# EAGLE design UnoAdapter_v10 (EAGLE 6.4)
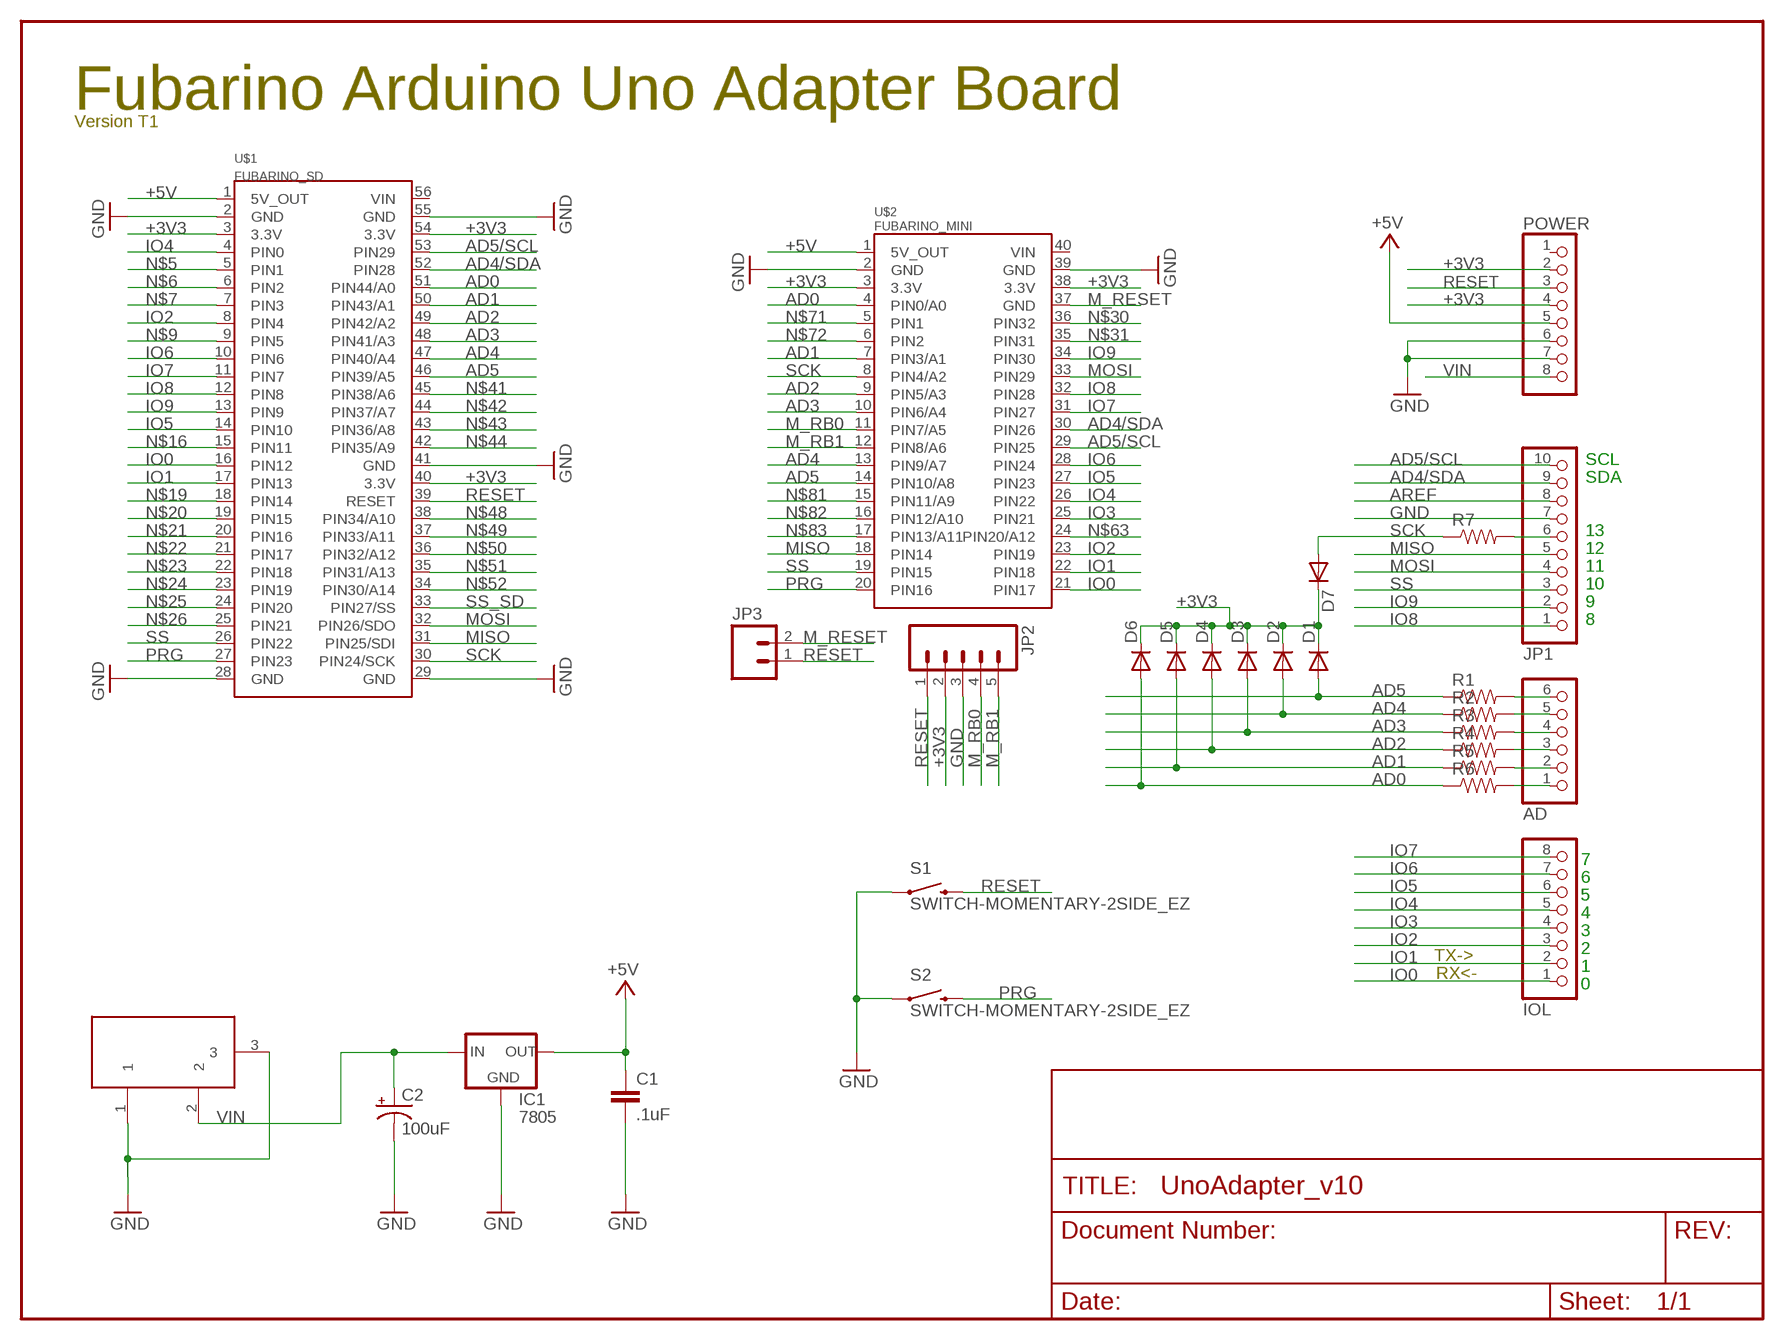
[diagram p0: schematic, sheet 1]

## Parts
AD  PINHD-1X6  [1X06]
C1  .1uF  CAPPTH  [CAP-PTH-SMALL]
C2  100uF  CAP_POLPTH1  [CPOL-RADIAL-100UF-25V]
D1  DIODE1N4148  [DIODE-1N4148]
D2  DIODE1N4148  [DIODE-1N4148]
D3  DIODE1N4148  [DIODE-1N4148]
D4  DIODE1N4148  [DIODE-1N4148]
D5  DIODE1N4148  [DIODE-1N4148]
D6  DIODE1N4148  [DIODE-1N4148]
D7  DIODE1N4148  [DIODE-1N4148]
IC1  7805  V_REG_78XXSIDE  [78XXL]
IOL  PINHD-1X8  [1X08]
JP1  PINHD-1X10  [1X10]
JP2  M05PTH  [1X05]
JP3  M02PTH  [1X02]
POWER  PINHD-1X8  [1X08]
R1  RESISTORAXIAL-0.3  [AXIAL-0.3]
R2  RESISTORAXIAL-0.3  [AXIAL-0.3]
R3  RESISTORAXIAL-0.3  [AXIAL-0.3]
R4  RESISTORAXIAL-0.3  [AXIAL-0.3]
R5  RESISTORAXIAL-0.3  [AXIAL-0.3]
R6  RESISTORAXIAL-0.3  [AXIAL-0.3]
R7  RESISTORAXIAL-0.3  [AXIAL-0.3]
S1  SWITCH-MOMENTARY-2SIDE_EZ  [TACTILE-PTH-SIDEEZ]
S2  SWITCH-MOMENTARY-2SIDE_EZ  [TACTILE-PTH-SIDEEZ]
U$1  FUBARINO_SD  [FUBARINO_SD]
U$2  FUBARINO_MINI  [FUBARINO_MINI]
X1  DC21MMX  [DC-21MM]

## Nets
$12: AD.6 R1.P$2
$13: AD.5 R2.P$2
$14: AD.4 R3.P$2
$15: AD.3 R4.P$2
$16: AD.2 R5.P$2
$17: AD.1 R6.P$2
$123: JP1.6 R7.P$2
+3V3: D1.C D2.C D3.C D4.C D5.C D6.C D7.C JP2.2 POWER.2 POWER.4 U$1.3(3.3V) U$1.40(3.3V) U$1.54(3.3V) U$2.3(3.3V) U$2.38(3.3V)
+5V: C1.1 IC1.OUT POWER.5 U$1.1(5V_OUT) U$2.1(5V_OUT)
AD0: D6.A R6.P$1 U$1.51(PIN44/A0) U$2.4(PIN0/A0)
AD1: D5.A R5.P$1 U$1.50(PIN43/A1) U$2.7(PIN3/A1)
AD2: D4.A R4.P$1 U$1.49(PIN42/A2) U$2.9(PIN5/A3)
AD3: D3.A R3.P$1 U$1.48(PIN41/A3) U$2.10(PIN6/A4)
AD4: D2.A R2.P$1 U$1.47(PIN40/A4) U$2.13(PIN9/A7)
AD4/SDA: JP1.9 U$1.52(PIN28) U$2.30(PIN26)
AD5: D1.A R1.P$1 U$1.46(PIN39/A5) U$2.14(PIN10/A8)
AD5/SCL: JP1.10 U$1.53(PIN29) U$2.29(PIN25)
AREF: JP1.8
GND: C1.2 C2.2(-) IC1.GND JP1.7 JP2.3 POWER.6 POWER.7 S1.1 S2.1 U$1.2(GND) U$1.28(GND) U$1.29(GND) U$1.41(GND) U$1.55(GND) U$2.2(GND) U$2.39(GND) X1.1 X1.3
IO0: IOL.1 U$1.16(PIN12) U$2.21(PIN17)
IO1: IOL.2 U$1.17(PIN13) U$2.22(PIN18)
IO2: IOL.3 U$1.8(PIN4) U$2.23(PIN19)
IO3: IOL.4 U$2.25(PIN21)
IO4: IOL.5 U$1.4(PIN0) U$2.26(PIN22)
IO5: IOL.6 U$1.14(PIN10) U$2.27(PIN23)
IO6: IOL.7 U$1.10(PIN6) U$2.28(PIN24)
IO7: IOL.8 U$1.11(PIN7) U$2.31(PIN27)
IO8: JP1.1 U$1.12(PIN8) U$2.32(PIN28)
IO9: JP1.2 U$1.13(PIN9) U$2.34(PIN30)
M_RB0: JP2.4 U$2.11(PIN7/A5)
M_RB1: JP2.5 U$2.12(PIN8/A6)
M_RESET: JP3.2 U$2.37(GND)
MISO: JP1.5 U$1.31(PIN25/SDI) U$2.18(PIN14)
MOSI: JP1.4 U$1.32(PIN26/SDO) U$2.33(PIN29)
N$5: U$1.5(PIN1)
N$6: U$1.6(PIN2)
N$7: U$1.7(PIN3)
N$9: U$1.9(PIN5)
N$16: U$1.15(PIN11)
N$19: U$1.18(PIN14)
N$20: U$1.19(PIN15)
N$21: U$1.20(PIN16)
N$22: U$1.21(PIN17)
N$23: U$1.22(PIN18)
N$24: U$1.23(PIN19)
N$25: U$1.24(PIN20)
N$26: U$1.25(PIN21)
N$30: U$2.36(PIN32)
N$31: U$2.35(PIN31)
N$41: U$1.45(PIN38/A6)
N$42: U$1.44(PIN37/A7)
N$43: U$1.43(PIN36/A8)
N$44: U$1.42(PIN35/A9)
N$48: U$1.38(PIN34/A10)
N$49: U$1.37(PIN33/A11)
N$50: U$1.36(PIN32/A12)
N$51: U$1.35(PIN31/A13)
N$52: U$1.34(PIN30/A14)
N$63: U$2.24(PIN20/A12)
N$71: U$2.5(PIN1)
N$72: U$2.6(PIN2)
N$81: U$2.15(PIN11/A9)
N$82: U$2.16(PIN12/A10)
N$83: U$2.17(PIN13/A11)
PRG: S2.2 U$1.27(PIN23) U$2.20(PIN16)
RESET: JP2.1 JP3.1 POWER.3 S1.2 U$1.39(RESET)
SCK: D7.A R7.P$1 U$1.30(PIN24/SCK) U$2.8(PIN4/A2)
SS: JP1.3 U$1.26(PIN22) U$2.19(PIN15)
SS_SD: U$1.33(PIN27/SS)
VIN: C2.1(+) IC1.IN POWER.8 X1.2
Unconnected: POWER.1 U$1.56(VIN) U$2.40(VIN)

## Notes on the sheet
- Fubarino Arduino Uno Adapter Board
- Version T1
- SCL
- SDA
- 13
- 12
- 11
- 10
- 9
- 8
- 7
- 6
- 5
- 4
- 3
- 2
- TX->
- 1
- RX<-
- 0

## Library data of the parts
AD = pinhead:PINHD-1X6: PIN HEADER
C1 = SparkFun-Capacitors:CAP: Capacitor Standard 0603 ceramic capacitor, and 0.1" leaded capacitor.
C2 = SparkFun-Capacitors:CAP_POL: Capacitor Polarized These are standard SMD and PTH capacitors. Normally 10uF, 47uF, and 100uF in electrolytic and tantalum varieties. Always verify the external diameter of the through hole cap, it varies with capacity, voltage, and manufacturer. The EIA devices should be standard.
D1-D7 = SparkFun-DiscreteSemi:DIODE: Diode These are standard reverse protection diodes and small signal diodes. SMA package can handle up to about 1A. SOD-323 can handle about 200mA. What the SOD-323 package when ordering, there are some mfgs out there that are 5-pin packages.
IC1 = SparkFun-PowerIC:V_REG_78XX: Voltage Regulator Standard 7805 5V regulator. IGO (Input Ground Output). Spark Fun Electronics SKU : COM-00107
IOL POWER = pinhead:PINHD-1X8: PIN HEADER
JP1 = pinhead:PINHD-1X10: PIN HEADER
JP2 = SparkFun-Connectors:M05: Header 5 Standard 5-pin 0.1" header. Use with straight break away headers (SKU : PRT-00116), right angle break away headers (PRT-00553), swiss pins (PRT-00743), machine pins (PRT-00117), and female headers (PRT-00115). Molex polarized connector foot print use with SKU : PRT-08230 with associated crimp pins and housings.
JP3 = SparkFun-Connectors:M02: Header 2 Standard 2-pin 0.1" header. Use with straight break away headers (SKU : PRT-00116), right angle break away headers (PRT-00553), swiss pins (PRT-00743), machine pins (PRT-00117), and female headers (PRT-00115). Molex polarized connector foot print use with SKU : PRT-08233 with associated crimp pins and housings.
R1-R7 = SparkFun-Passives:RESISTOR: Resistor Basic schematic elements and footprints for 0603, 1206, and PTH resistors.
S1 S2 = SparkFun-Electromechanical:SWITCH-MOMENTARY-2: Various NO switches- pushbuttons, reed, etc
U$1 = SchmalzHausPublic:FUBARINO_SD
U$2 = SchmalzHausPublic:FUBARINO_MINI
X1 = powersupply:DC21MM

## Net classes
0 default: width 0.152 mm, drill 0.305 mm, clearance 0.152 mm

## Board
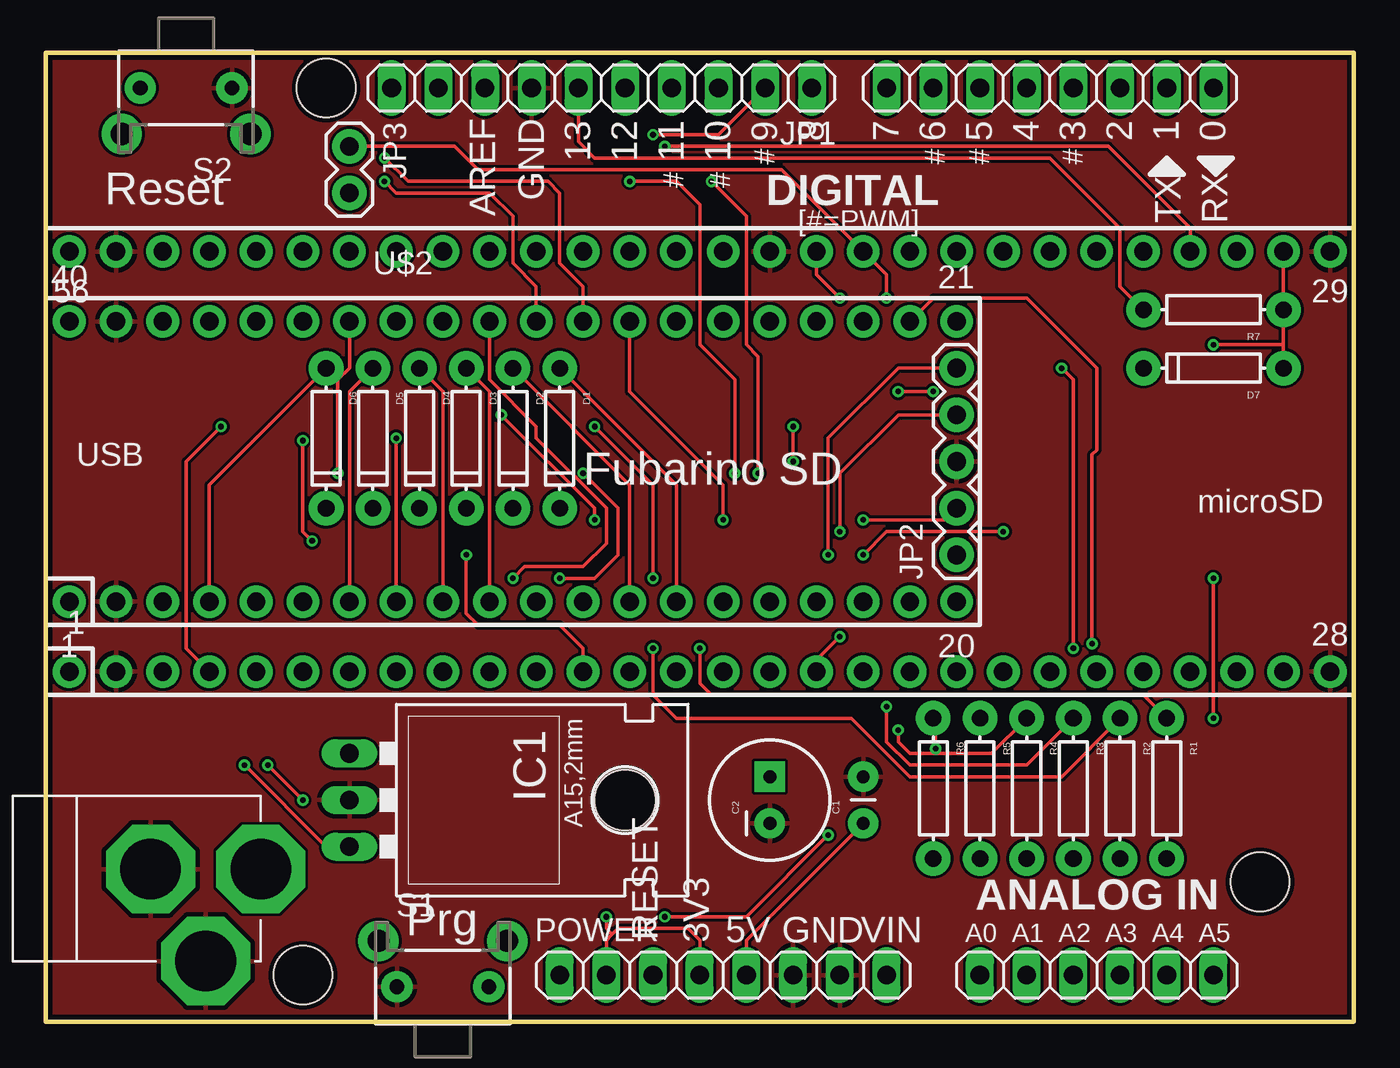
[diagram p1: board, top side]
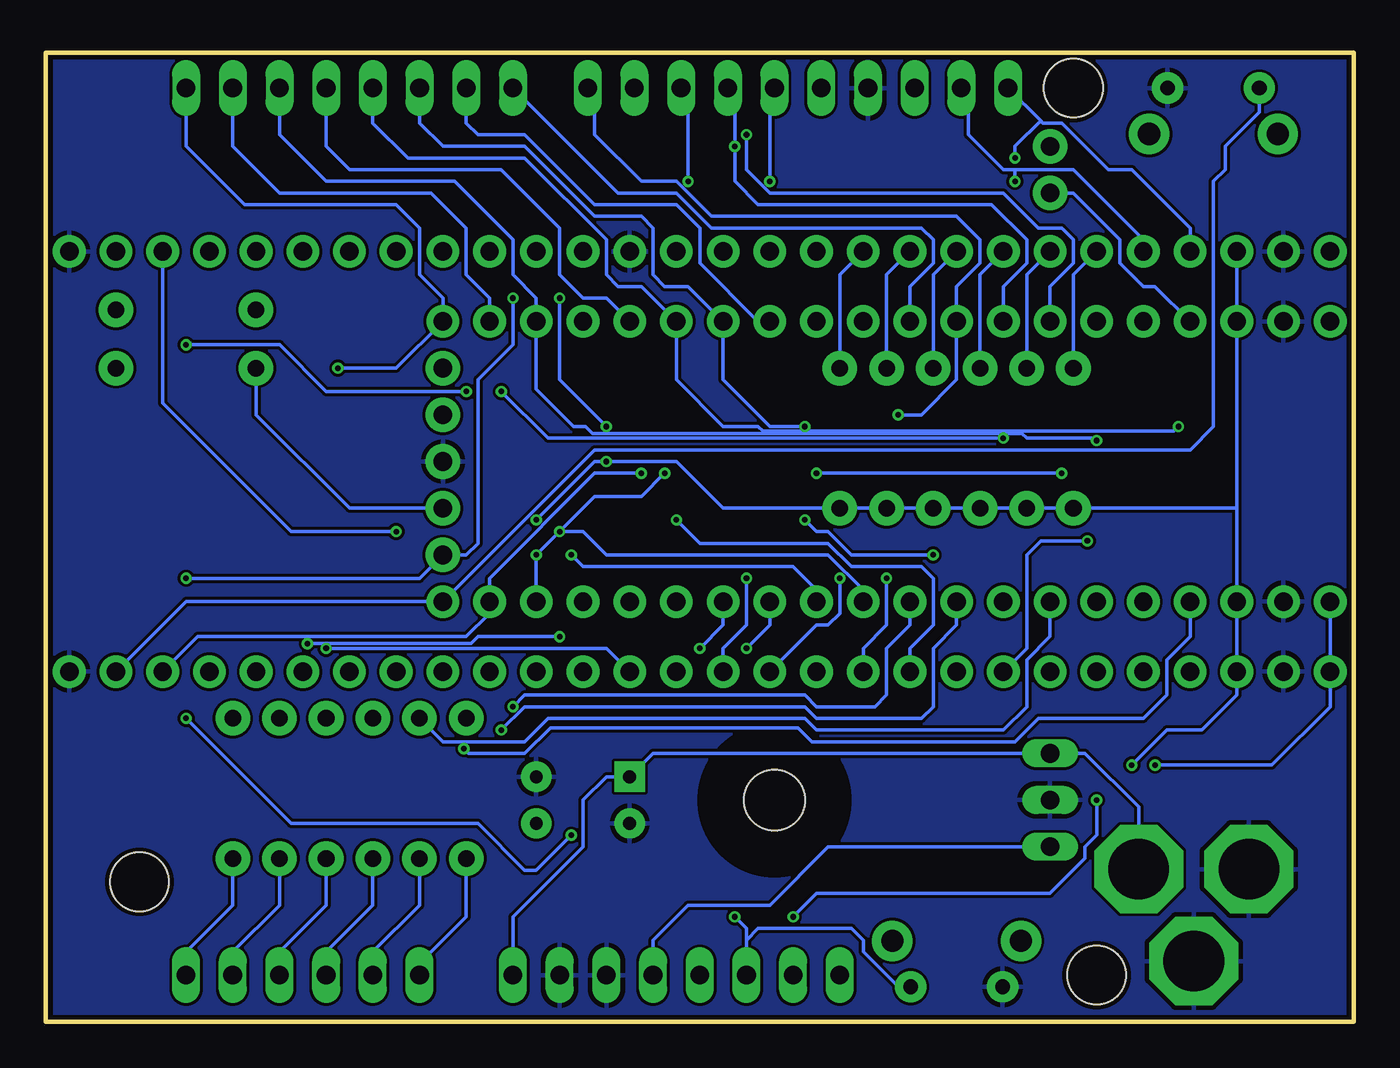
[diagram p2: board, bottom side, seen from below]

Size 71.12 x 52.7 mm. Coordinates in mm from the lower left corner, seen from the top.
Outline: 0,52.7 71.12,52.7 71.12,0 0,0 0,52.7
Copper layers (1*16): Top 0.035mm / dielectric 1.5mm / Bottom 0.035mm
Design rules "Fusion_eagle_rule_v1.1": minimum track width 6mil, minimum drill 12mil, track to track 6mil, track to pad 6mil, pad to pad 6mil, via to via 6mil, smd to smd 0mil, copper to edge 10mil, drill to drill 10mil, minimum pad ring 10mil, minimum via ring 6mil, stop-mask expansion 2mil, vias tented up to drill 100mil, thermal gap 10mil
Holes 3.2 mm at 66.04,7.62 15.24,50.8 13.97,2.54

### Footprints (pad centres in the part's own frame; a part is rotated, then mirrored left to right if it is on the bottom)
1X06 = drill 1.016 long: 1 -6.35,0; 2 -3.81,0; 3 -1.27,0; 4 1.27,0; 5 3.81,0; 6 6.35,0
CAP-PTH-SMALL = drill 0.7 pad 1.651: 1 0,0; 2 2.54,0
CPOL-RADIAL-100UF-25V = drill 0.7 pad 1.651 square: 1 1.27,0 | drill 0.7 pad 1.651: 2 -1.27,0
DIODE-1N4148 = drill 0.9 pad 1.88: A -3.81,0; C 3.81,0
78XXL = drill 1.016 long: GND 0,-3.81; IN -2.54,-3.81; OUT 2.54,-3.81 | hole 3.302: 0,11.176
1X08 = drill 1.016 long: 1 -8.89,0; 2 -6.35,0; 3 -3.81,0; 4 -1.27,0; 5 1.27,0; 6 3.81,0; 7 6.35,0; 8 8.89,0
1X10 = drill 1.016 long: 1 -11.43,0; 2 -8.89,0; 3 -6.35,0; 4 -3.81,0; 5 -1.27,0; 6 1.27,0; 7 3.81,0; 8 6.35,0; 9 8.89,0; 10 11.43,0
1X05 = drill 1.016 pad 1.88: 1 0,0; 2 2.54,0; 3 5.08,0; 4 7.62,0; 5 10.16,0
1X02 = drill 1.016 pad 1.88: 1 0,0; 2 2.54,0
AXIAL-0.3 = drill 0.9 pad 1.88: P$1 -3.81,0; P$2 3.81,0
TACTILE-PTH-SIDEEZ = drill 0.8 pad 1.7: 1 -2.5,0; 2 2.5,0 | drill 1.2 pad 2.2: ANCHOR1 -3.5,2.5; ANCHOR2 3.5,2.5
FUBARINO_SD = drill 1 pad 1.778: 1 -34.29,-11.43; 2 -31.75,-11.43; 3 -29.21,-11.43; 4 -26.67,-11.43; 5 -24.13,-11.43; 6 -21.59,-11.43; 7 -19.05,-11.43; 8 -16.51,-11.43; 9 -13.97,-11.43; 10 -11.43,-11.43; 11 -8.89,-11.43; 12 -6.35,-11.43; 13 -3.81,-11.43; 14 -1.27,-11.43; 15 1.27,-11.43; 16 3.81,-11.43; 17 6.35,-11.43; 18 8.89,-11.43; 19 11.43,-11.43; 20 13.97,-11.43; 21 16.51,-11.43; 22 19.05,-11.43; 23 21.59,-11.43; 24 24.13,-11.43; 25 26.67,-11.43; 26 29.21,-11.43; 27 31.75,-11.43; 28 34.29,-11.43; 29 34.29,11.43; 30 31.75,11.43; 31 29.21,11.43; 32 26.67,11.43; 33 24.13,11.43; 34 21.59,11.43; 35 19.05,11.43; 36 16.51,11.43; 37 13.97,11.43; 38 11.43,11.43; 39 8.89,11.43; 40 6.35,11.43; 41 3.81,11.43; 42 1.27,11.43; 43 -1.27,11.43; 44 -3.81,11.43; 45 -6.35,11.43; 46 -8.89,11.43; 47 -11.43,11.43; 48 -13.97,11.43; 49 -16.51,11.43; 50 -19.05,11.43; 51 -21.59,11.43; 52 -24.13,11.43; 53 -26.67,11.43; 54 -29.21,11.43; 55 -31.75,11.43; 56 -34.29,11.43
FUBARINO_MINI = drill 1 pad 1.778: 1 -24.13,-7.62; 2 -21.59,-7.62; 3 -19.05,-7.62; 4 -16.51,-7.62; 5 -13.97,-7.62; 6 -11.43,-7.62; 7 -8.89,-7.62; 8 -6.35,-7.62; 9 -3.81,-7.62; 10 -1.27,-7.62; 11 1.27,-7.62; 12 3.81,-7.62; 13 6.35,-7.62; 14 8.89,-7.62; 15 11.43,-7.62; 16 13.97,-7.62; 17 16.51,-7.62; 18 19.05,-7.62; 19 21.59,-7.62; 20 24.13,-7.62; 21 24.13,7.62; 22 21.59,7.62; 23 19.05,7.62; 24 16.51,7.62; 25 13.97,7.62; 26 11.43,7.62; 27 8.89,7.62; 28 6.35,7.62; 29 3.81,7.62; 30 1.27,7.62; 31 -1.27,7.62; 32 -3.81,7.62; 33 -6.35,7.62; 34 -8.89,7.62; 35 -11.43,7.62; 36 -13.97,7.62; 37 -16.51,7.62; 38 -19.05,7.62; 39 -21.59,7.62; 40 -24.13,7.62
DC-21MM = drill 3.302 pad 4.826 octagon: 1 -5.08,-3.353; 2 -0.076,-6.35; 3 -0.076,-0.356

### Placement (x,y rotation side)
AD  57.15,2.54 0 top
C1  44.45,10.79 90 top
C2  39.37,12.06 90 top
D1  27.94,31.75 270 top
D2  25.4,31.75 270 top
D3  22.86,31.75 270 top
D4  20.32,31.75 270 top
D5  17.78,31.75 270 top
D6  15.24,31.75 270 top
D7  63.5,35.56 180 top
IC1  20.32,12.06 270 top
IOL  54.61,50.8 180 top
JP1  30.23,50.8 180 top
JP2  49.53,25.4 90 top
JP3  16.51,47.62 270 top
POWER  36.83,2.54 0 top
R1  60.96,12.7 270 top
R2  58.42,12.7 270 top
R3  55.88,12.7 270 top
R4  53.34,12.7 270 top
R5  50.8,12.7 270 top
R6  48.26,12.7 270 top
R7  63.5,38.73 180 top
S1  21.59,1.91 0 top
S2  7.62,50.8 180 top
U$1  35.56,30.48 0 top
U$2  25.4,30.48 0 top
X1  5.33,8.38 90 top

### Tracks (layer width: path | path; a pad name or v marks a point on that pad's centre or on a via)
$12
  Bottom 0.203: AD.6 63.5,3.81 60.96,6.35 R1.P$2
$13
  Bottom 0.203: AD.5 60.96,3.81 58.42,6.35 R2.P$2
$14
  Bottom 0.203: AD.4 58.42,3.81 55.88,6.35 R3.P$2
$15
  Bottom 0.203: AD.3 55.88,3.81 53.34,6.35 R4.P$2
$16
  Bottom 0.203: AD.2 53.34,3.81 50.8,6.35 R5.P$2
$17
  Bottom 0.203: AD.1 50.8,3.17 48.26,5.71 R6.P$2
$123
  Top 0.203: JP1.6 28.96,47.88 29.84,46.99 54.61,46.99 58.42,43.18 58.42,40.01 R7.P$2
+3V3  (via drill 0.3)
  Top 0.203: POWER.2 30.48,4.45 30.8,4.76 | 30.8,4.76 31.11,5.08 34.92,5.08 35.56,4.45 POWER.4 | v44.45,27.3 48.9,27.3 JP2.2 | U$1.40 41.91,40.64 v43.18,39.37 | v40.64,32.38 v40.64,30.48 | v12.06,13.97 v13.97,12.06 | v30.48,5.71 30.48,5.08 30.8,4.76
  Bottom 0.203: 6.35,27.94 U$2.3 U$1.3 6.35,17.78 8.26,15.88 10.16,15.88 v12.06,13.97 | 6.35,27.94 U$2.38 U$1.54 | 6.35,27.94 D6.C D5.C D4.C D3.C D2.C D1.C 34.29,27.94 36.83,30.48 v40.64,30.48 41.27,30.48 v44.45,27.3 | JP2.2 54.61,27.94 59.69,33.02 D7.C | v43.18,39.37 43.18,34.92 v40.64,32.38 | v13.97,12.06 13.97,10.16 14.61,9.53 14.61,8.89 16.51,6.99 29.21,6.99 v30.48,5.71
+5V  (via drill 0.3)
  Top 0.203: C1.1 38.1,4.45 POWER.5 | IC1.OUT 15.24,9.53 v10.79,13.97
  Bottom 0.203: IC1.OUT 28.57,9.53 31.75,6.35 36.2,6.35 38.1,4.45 POWER.5 | v10.79,13.97 4.45,13.97 1.27,17.14 U$1.1 U$2.1
AD0  (via drill 0.3)
  Top 0.203: U$2.4 8.89,29.21 D6.A | v48.39,14.86 48.39,16.38 R6.P$1
  Bottom 0.203: D6.A 15.24,40.64 U$1.51 | U$2.4 8.89,20.95 10.16,19.68 10.16,17.78 11.43,16.51 17.14,16.51 18.41,15.24 29.46,15.24 30.23,16 43.69,16 45.09,14.61 48.13,14.61 v48.39,14.86
AD1
  Top 0.203: U$2.7 16.51,34.29 D5.A
  Bottom 0.203: D5.A 17.78,40.64 U$1.50 | U$2.7 16.51,20.95 17.78,19.68 17.78,17.14 19.05,15.88 29.21,15.88 29.84,16.51 43.81,16.51 45.09,15.24 49.53,15.24 R5.P$1
AD2  (via drill 0.3)
  Top 0.203: U$2.9 21.59,34.29 D4.A | v46.35,15.88 46.35,15.24 46.99,14.61 51.44,14.61 R4.P$1
  Bottom 0.203: D4.A 20.32,40.64 U$1.49 | U$2.9 21.59,21.59 22.86,20.32 22.86,17.14 23.5,16.51 29.21,16.51 29.84,17.14 45.09,17.14 v46.35,15.88
AD3  (via drill 0.3)
  Top 0.203: U$2.10 24.13,34.29 D3.A | v45.72,17.14 45.72,15.24 46.99,13.97 53.34,13.97 R3.P$1
  Bottom 0.203: D3.A 22.86,40.64 U$1.48 | U$2.10 24.13,21.59 25.4,20.32 25.4,17.78 26.04,17.14 29.21,17.14 29.84,17.78 45.09,17.78 v45.72,17.14
AD4  (via drill 0.3)
  Top 0.203: U$2.13 31.75,29.21 D2.A | v33.02,20.32 33.02,17.78 34.29,16.51 43.81,16.51 46.99,13.34 55.24,13.34 R2.P$1
  Bottom 0.203: D2.A 25.4,40.64 U$1.47 | U$2.13 31.75,21.59 v33.02,20.32
AD4/SDA  (via drill 0.3)
  Top 0.203: U$2.30 26.67,40.01 25.4,41.27 25.4,43.81 24.13,45.09 19.05,45.09 v18.41,45.72
  Bottom 0.203: U$1.52 11.43,42.55 15.24,46.35 18.41,46.35 | 18.41,46.35 19.05,46.35 20.95,48.26 20.95,50.42 JP1.9 | v18.41,45.72 18.41,46.35
AD5  (via drill 0.3)
  Top 0.203: U$2.14 34.29,29.21 D1.A | v35.56,20.32 35.56,18.41 36.2,17.78 59.69,17.78 R1.P$1
  Bottom 0.203: D1.A 27.94,40.64 U$1.46 | U$2.14 34.29,21.59 v35.56,20.32
AD5/SCL  (via drill 0.3)
  Top 0.203: U$2.29 29.21,40.01 27.94,41.27 27.94,45.09 27.3,45.72 19.68,45.72 v18.41,46.99
  Bottom 0.203: U$1.53 8.89,43.18 12.06,46.35 13.34,46.35 15.88,48.9 16.89,48.9 17.02,49.02 | 17.02,49.02 JP1.10 | v18.41,46.99 18.41,47.62 17.02,49.02
GND
  pour Bottom (rank 2): 0,52.7 71.12,52.7 71.12,0 0,0
  pour Top (rank 2): 0,52.7 71.12,52.7 71.12,0 0,0
IO0  (via drill 0.3)
  Top 0.203: v55.88,20.32 55.88,34.92 v55.24,35.56
  Bottom 0.203: U$1.16 40.64,20.32 v55.88,20.32 | IOL.1 63.5,47.62 60.33,44.45 52.07,44.45 50.8,43.18 50.8,40.64 49.53,39.37 U$2.21 52.07,35.56 v55.24,35.56
IO1  (via drill 0.3)
  Top 0.203: U$1.17 41.91,19.68 v43.18,20.95 | v56.9,20.57 56.9,30.86 57.15,31.11 57.15,35.56 53.34,39.37 48.26,39.37 U$2.22
  Bottom 0.203: v43.18,20.95 47.62,20.95 48.01,20.57 v56.9,20.57 | U$2.22 46.99,39.37 48.26,40.64 48.26,43.18 50.16,45.09 58.42,45.09 60.96,47.62 IOL.2
IO2  (via drill 0.3)
  Top 0.203: v13.97,31.62 13.97,26.67 v14.48,26.16
  Bottom 0.203: IOL.3 58.42,48.26 55.88,45.72 48.9,45.72 45.72,42.55 45.72,40.64 44.45,39.37 U$2.23 44.45,34.42 42.42,32.38 41.78,32.38 41.4,32 18.03,32 17.78,31.75 14.1,31.75 v13.97,31.62 | v14.48,26.16 17.02,26.16 17.78,25.4 17.78,20.32 U$1.8
IO3
  Bottom 0.203: U$2.25 40.64,39.37 41.91,39.37 43.18,40.64 43.18,43.18 46.35,46.35 54.61,46.35 55.88,47.62 IOL.4
IO4  (via drill 0.3)
  Top 0.203: v9.53,32.38 7.62,30.48 7.62,20.32 U$1.4
  Bottom 0.203: IOL.5 53.34,48.9 51.44,46.99 45.09,46.99 40.64,42.55 40.64,40.64 40.01,40.01 38.73,40.01 U$2.26 36.83,34.92 34.29,32.38 32.38,32.38 32.13,32.13 9.78,32.13 v9.53,32.38
IO5  (via drill 0.3)
  Top 0.203: v33.02,24.13 33.02,29.21 v29.84,32.38
  Bottom 0.203: IOL.6 50.8,48.9 49.53,47.62 45.09,47.62 41.27,43.81 38.73,43.81 38.1,43.18 38.1,40.64 37.47,40.01 36.2,40.01 U$2.27 34.29,34.92 31.75,32.38 v29.84,32.38 | U$1.14 34.29,20.32 33.02,21.59 v33.02,24.13
IO6  (via drill 0.3)
  Top 0.203: v36.83,27.3 36.83,29.21 31.75,34.29 U$2.28
  Bottom 0.203: U$2.28 32.38,38.1 35.56,41.27 35.56,43.18 36.83,44.45 41.27,44.45 45.09,48.26 47.62,48.26 48.26,48.9 IOL.7 | U$1.10 24.13,20.32 22.86,21.59 22.86,24.13 23.5,24.77 27.3,24.77 28.57,26.04 35.56,26.04 v36.83,27.3
IO7  (via drill 0.3)
  Top 0.203: v25.4,24.13 26.04,24.77 29.21,24.77 30.48,26.04 30.48,27.94 26.67,31.75 26.67,32.38 24.13,34.92 U$2.31
  Bottom 0.203: U$2.31 24.13,40.01 22.86,41.27 22.86,42.55 23.5,43.18 34.92,43.18 36.83,45.09 40.01,45.09 IOL.8 | U$1.11 26.67,20.32 25.4,21.59 v25.4,24.13
IO8  (via drill 0.3)
  Top 0.203: U$1.12 29.21,20.32 27.94,21.59 23.5,21.59 22.86,22.23 v22.86,25.4 | v29.84,27.3 29.84,27.94 v24.77,33.02
  Bottom 0.203: JP1.1 41.27,50.42 41.27,48.26 38.73,45.72 36.83,45.72 34.92,43.81 21.59,43.81 20.32,42.55 20.32,41.27 21.59,40.01 U$2.32 21.59,34.92 23.5,33.02 v24.77,33.02 | v22.86,25.4 27.3,25.4 28.57,26.67 29.21,26.67 v29.84,27.3
IO9  (via drill 0.3)
  Top 0.203: v33.02,48.26 36.58,48.26 JP1.2 | v27.94,24.13 29.84,24.13 31.11,25.4 31.11,27.94 v29.21,29.84 | v15.88,29.84 15.88,34.92 16.51,35.56 U$2.34
  Bottom 0.203: U$2.34 16.51,40.01 15.24,41.27 15.24,42.55 15.88,43.18 17.14,43.18 19.05,45.09 31.75,45.09 33.02,46.35 v33.02,48.26 | U$1.13 29.21,21.59 28.57,21.59 27.94,22.23 v27.94,24.13 | v29.21,29.84 v15.88,29.84
M_RB0  (via drill 0.3)
  Top 0.203: v43.18,26.67 43.18,29.84 46.35,33.02 JP2.4
  Bottom 0.203: U$2.11 26.67,23.5 28.57,25.4 40.64,25.4 41.91,26.67 v43.18,26.67
M_RB1  (via drill 0.3)
  Top 0.203: v42.55,25.4 42.55,31.75 46.35,35.56 JP2.5
  Bottom 0.203: U$2.12 29.21,23.5 30.48,24.77 41.91,24.77 v42.55,25.4
M_RESET
  Bottom 0.203: U$2.37 10.79,40.01 11.43,40.01 12.7,41.27 12.7,42.55 15.24,45.09 JP3.2
MISO  (via drill 0.3)
  Top 0.203: v37.47,29.84 37.47,34.92 35.56,36.83 35.56,44.45 34.29,45.72 v31.75,45.72 | v44.45,25.4 45.72,26.67 v52.07,26.67
  Bottom 0.203: U$2.18 v44.45,25.4 41.27,28.57 38.73,28.57 v37.47,29.84 | v31.75,45.72 31.75,50.55 JP1.5 | v52.07,26.67 57.78,26.67 64.77,33.66 U$1.31
MOSI  (via drill 0.3)
  Top 0.203: v33.66,47.62 57.78,47.62 62.23,43.18 U$1.32
  Bottom 0.203: U$2.33 19.05,40.01 17.78,41.27 17.78,42.55 19.68,44.45 32.38,44.45 33.66,45.72 v33.66,47.62 33.66,50.42 JP1.4
PRG
  Bottom 0.203: U$1.27 63.5,22.86 U$2.20 41.27,31.11 8.89,31.11 7.62,32.38 7.62,45.72 6.99,46.35 6.99,47.62 5.12,49.49 S2.2
RESET  (via drill 0.3)
  Top 0.203: JP3.1 22.23,47.62 23.5,46.35 40.01,46.35 U$1.39 45.72,40.64 v45.72,39.37 | v33.66,5.71 38.1,5.71 v42.55,10.16 | v63.5,16.51 v63.5,24.13
  Bottom 0.203: S1.2 24.77,1.91 26.67,3.81 26.67,4.45 27.3,5.08 32.38,5.08 33.02,4.45 | 33.02,4.45 POWER.3 | v45.72,39.37 45.72,36.83 47.62,34.92 47.62,26.04 48.26,25.4 JP2.1 50.8,24.13 v63.5,24.13 | 33.02,4.45 33.02,5.08 v33.66,5.71 | v42.55,10.16 44.45,8.26 45.09,8.26 47.62,10.79 57.78,10.79 v63.5,16.51
SCK  (via drill 0.3)
  Top 0.203: D7.A 67.31,36.83 | 67.31,36.83 R7.P$1 U$1.30 | U$2.8 v19.05,31.75 | v46.35,34.29 v48.26,34.29 | v63.5,36.83 67.31,36.83
  Bottom 0.203: v19.05,31.75 43.81,31.75 v46.35,34.29 | v48.26,34.29 55.88,34.29 58.42,36.83 v63.5,36.83
SS  (via drill 0.3)
  Top 0.203: v38.73,29.84 38.73,36.2 38.1,36.83 38.1,43.81 v36.2,45.72
  Bottom 0.203: U$1.26 62.87,20.95 48.26,20.95 46.99,22.23 U$2.19 46.99,24.13 41.27,29.84 v38.73,29.84 | v36.2,45.72 36.2,50.42 JP1.3
VIN
  Bottom 0.203: X1.2 11.68,11.68 14.61,14.61 IC1.IN 38.1,14.61 C2.1 40.64,13.34 41.91,12.06 41.91,9.53 45.72,5.71 POWER.8

### Text on the board
tPlace: 13 | 12 | 11 | 10 | 9 | 8 | 7 | 6 | 5 | 4 | 3 | 2 | 1 | 0 | Reset | Prg
tNames: AREF | GND | # | # | # | # | # | # | DIGITAL | [#=PWM] | TX | RX | ANALOG IN | RESET | 3V3 | 5V | GND | VIN | A0 | A1 | A2 | A3 | A4 | A5
214bmp: D:/SmartProjects/Snc/a4_bn_logo2.bmp